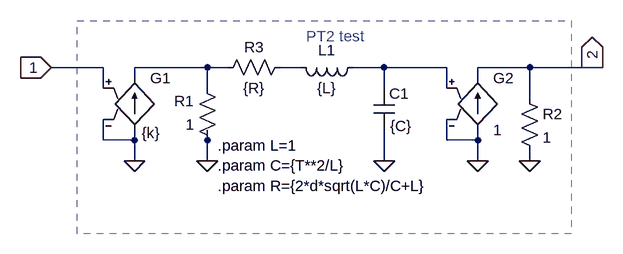
[diagram p0: schematic PT2_selfmade.asc]
PT2_selfmade.asc, the LTspice schematic file:
Version 4
SHEET 1 1168 680
WIRE 352 112 272 112
WIRE 512 112 400 112
WIRE 544 112 512 112
WIRE 656 112 624 112
WIRE 784 112 736 112
WIRE 880 112 784 112
WIRE 1008 112 928 112
WIRE 1104 112 1008 112
WIRE 1120 112 1104 112
WIRE 400 128 400 112
WIRE 928 128 928 112
WIRE 352 144 352 112
WIRE 512 144 512 112
WIRE 784 144 784 112
WIRE 880 144 880 112
WIRE 1008 160 1008 112
WIRE 352 224 352 192
WIRE 400 224 400 208
WIRE 400 224 352 224
WIRE 512 224 512 208
WIRE 880 224 880 192
WIRE 928 224 928 208
WIRE 928 224 880 224
WIRE 400 256 400 224
WIRE 512 256 512 224
WIRE 784 256 784 208
WIRE 928 256 928 224
WIRE 1008 256 1008 240
FLAG 400 256 0
FLAG 928 256 0
FLAG 512 256 0
FLAG 1008 256 0
FLAG 784 256 0
FLAG 272 112 1
IOPIN 272 112 In
FLAG 1104 112 2
IOPIN 1104 112 Out
SYMBOL res 528 240 R180
WINDOW 0 36 76 Left 2
WINDOW 3 36 40 Left 2
SYMATTR InstName R1
SYMATTR Value 1
SYMBOL g 400 112 R0
WINDOW 3 11 101 Left 2
SYMATTR Value {k}
SYMATTR InstName G1
SYMBOL g 928 112 R0
SYMATTR InstName G2
SYMATTR Value 1
SYMBOL res 992 144 R0
SYMATTR InstName R2
SYMATTR Value 1
SYMBOL ind 752 96 R90
WINDOW 0 5 56 VBottom 2
WINDOW 3 32 56 VTop 2
SYMATTR InstName L1
SYMATTR Value {L}
SYMBOL cap 768 144 R0
WINDOW 3 25 58 Left 2
SYMATTR Value {C}
SYMATTR InstName C1
SYMBOL res 640 96 R90
WINDOW 0 0 56 VBottom 2
WINDOW 3 32 56 VTop 2
SYMATTR InstName R3
SYMATTR Value {R}
TEXT 664 64 Left 2 ;PT2 test
TEXT 528 232 Left 2 !.param L=1\n.param C={T**2/L}\n.param R={2*d*sqrt(L*C)/C+L}
RECTANGLE Normal 1072 368 312 40 2

The netlist it stands for:
* PT2_selfmade.asc
R1 0 N001 1
G1 0 N001 1 0 {k}
G2 0 2 N003 0 1
R2 2 0 1
L1 N003 N002 {L}
C1 N003 0 {C}
R3 N002 N001 {R}
* PT2 test
.param L=1
.param C={T**2/L}
.param R={2*d*sqrt(L*C)/C+L}
.backanno
.end